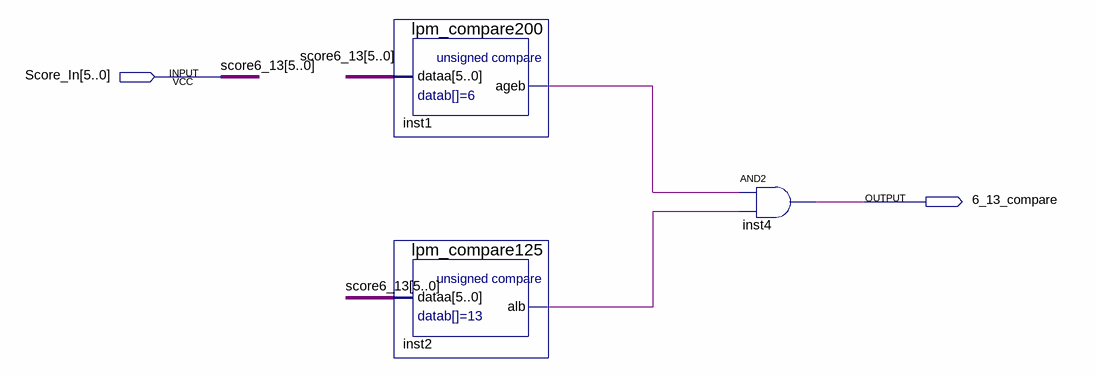
[diagram p0: schematic sheet]
// Quartus schematic 6_13_compare.bdf as structural Verilog: 3 symbols, 2 pins
module \6_13_compare  (
  input  [5:0] Score_In,
  output \6_13_compare 
);

  wire inst1_ageb, inst2_alb;

  lpm_compare200 inst1 (.dataa(Score_In), .ageb(inst1_ageb));
  lpm_compare125 inst2 (.dataa(Score_In), .alb(inst2_alb));
  and inst4 (\6_13_compare , inst1_ageb, inst2_alb);

  // Other names for the same wires on the sheet: score6_13[5:0] = Score_In
endmodule
